# Altium schematic sheet Interface.SchDoc
size A
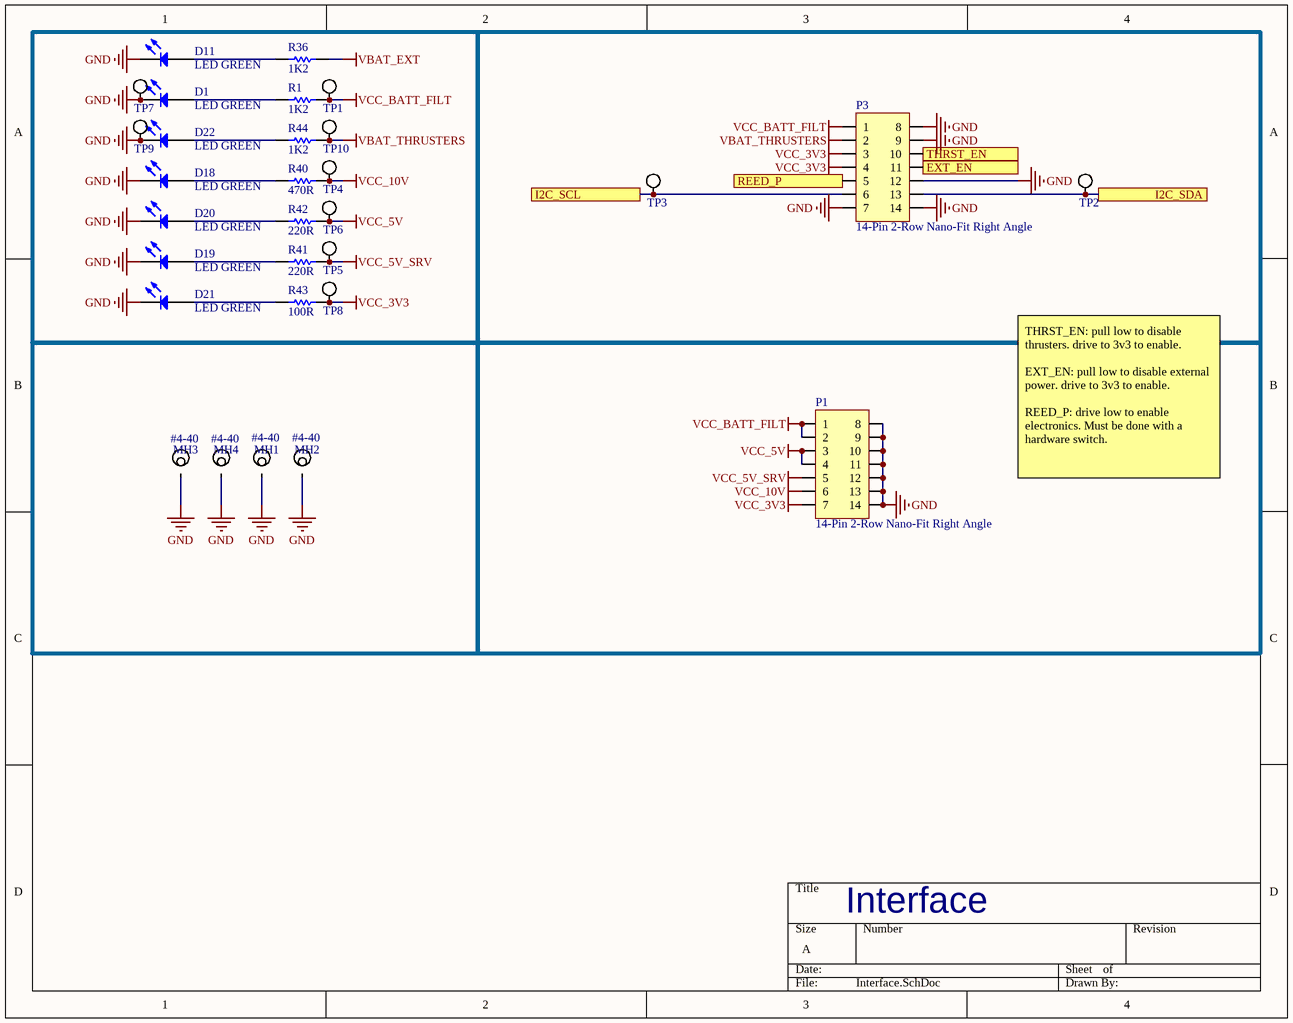
[diagram p0: Interface.SchDoc]

## Parts
D1  LED GREEN  [LED_0805]
D11  LED GREEN  [LED_0805]
D18  LED GREEN  [LED_0805]
D19  LED GREEN  [LED_0805]
D20  LED GREEN  [LED_0805]
D21  LED GREEN  [LED_0805]
D22  LED GREEN  [LED_0805]
MH1  #4-40  [Mounting Hole #4-40]
MH2  #4-40  [Mounting Hole #4-40]
MH3  #4-40  [Mounting Hole #4-40]
MH4  #4-40  [Mounting Hole #4-40]
P1  14-Pin 2-Row Nano-Fit Right Angle  [MOLEX NANO-FIT 2X7 - Right Angle]
P3  14-Pin 2-Row Nano-Fit Right Angle  [MOLEX NANO-FIT 2X7 - Right Angle]
R1  1K2  [RESC0603(1608)_L]
R36  1K2  [RESC0603(1608)_L]
R40  470R  [RESC0603(1608)_L]
R41  220R  [RESC0603(1608)_L]
R42  220R  [RESC0603(1608)_L]
R43  100R  [RESC0603(1608)_L]
R44  1K2  [RESC0603(1608)_L]
TP1  Test Point Loop  [Test Point Loop - Black]  (value not drawn)
TP2  Test Point Loop  [Test Point Loop - Black]  (value not drawn)
TP3  Test Point Loop  [Test Point Loop - Black]  (value not drawn)
TP4  Test Point Loop  [Test Point Loop - Black]  (value not drawn)
TP5  Test Point Loop  [Test Point Loop - Black]  (value not drawn)
TP6  Test Point Loop  [Test Point Loop - Black]  (value not drawn)
TP7  Test Point Loop  [Test Point Loop - Black]  (value not drawn)
TP8  Test Point Loop  [Test Point Loop - Black]  (value not drawn)
TP9  Test Point Loop  [Test Point Loop - Black]  (value not drawn)
TP10  Test Point Loop  [Test Point Loop - Black]  (value not drawn)

## Ports
EXT_EN (out), I2C_SCL, I2C_SDA, REED_P, THRST_EN (out)

## Nets
GND: D1.1(K) D11.1(K) D18.1(K) D19.1(K) D20.1(K) D21.1(K) D22.1(K) MH1.0 MH2.0 MH3.0 MH4.0 P1.8 P1.9 P1.10 P1.11 P1.12 P1.13 P1.14 P3.7 P3.8 P3.9 P3.12 P3.14 TP7.1 TP9.1
VBAT_EXT: R36.2
VBAT_THRUSTERS: P3.2 R44.2 TP10.1
VCC_3V3: P1.7 P3.3 P3.4 R43.2 TP8.1
VCC_5V: P1.3 P1.4 R42.2 TP6.1
VCC_5V_SRV: P1.5 R41.2 TP5.1
VCC_10V: P1.6 R40.2 TP4.1
VCC_BATT_FILT: P1.1 P1.2 P3.1 R1.2 TP1.1
EXT_EN: P3.11 ; port EXT_EN
I2C_SCL: P3.6 TP3.1 ; port I2C_SCL
I2C_SDA: P3.13 TP2.1 ; port I2C_SDA
REED_P: P3.5 ; port REED_P
THRST_EN: P3.10 ; port THRST_EN
NetD1_2: D1.2(A) R1.1
NetD11_2: D11.2(A) R36.1
NetD18_2: D18.2(A) R40.1
NetD19_2: D19.2(A) R41.1
NetD20_2: D20.2(A) R42.1
NetD21_2: D21.2(A) R43.1
NetD22_2: D22.2(A) R44.1

## Notes on the sheet
- THRST_EN: pull low to disable thrusters. drive to 3v3 to enable.
  EXT_EN: pull low to disable external power. drive to 3v3 to enable.
  REED_P: drive low to enable electronics. Must be done with a hardware switch.
- Interface

## Library data of the parts
D1 D11 D18-D22 = LED0: led; Manufacturer: Lite-On Inc.; Manufacturer Part Number: LTST-C171KGKT; Lens Color: Colorless; Lens Transparency: Clear; Millicandela Rating: 35mcd; Lens Style/Size: Rectangle with Flat Top, 1.40mm x 1.25mm; Voltage - Forward (Vf) (Typ): 2V; Current - Test: 20mA; Viewing Angle: 130°; Wavelength - Dominant: 571nm; Wavelength - Peak: 574nm; Supplier 1: Digi-Key; Supplier Part Number 1: 160-1426-1-ND; RoHS: RoHS Compliant; Category: Optoelectronics; Stock 1: 350441; Pricing 1: 1=0.31, 10=0.225, 25=0.1656, 100=0.1183, 250=0.0804, 500=0.07096, 1000=0.05558 (USD); Packaging: Cut Tape (CT); Part Status: Active; Color: Green; Mounting Type: Surface Mount; Features: -; Package / Case: 0805 (2012 Metric); Size / Dimension: 2.00mm L x 1.25mm W; Height (Max): 0.90mm; ComponentLink1URL: http://optoelectronics.liteon.com/upload/download/DS22-2000-118/LTST-C171KGKT.pdf; ComponentLink1Description: http://optoelectronics.liteon.com/upload/download/DS22-2000-118/LTST-C171KGKT.pdf
MH1-MH4 = Mounting Hole #4-40, Loose Fit: Mounting Hole for ANSI #4-40 w/ Flat Washer, Loose Fit; Datasheet: http://blogs.mentor.com/tom-hausherr/blog/tag/pcb-mounting-holes/
P1 P3 = 14-Pin 2-Row Nano-Fit Right Angle: NanoFit Right Hdr TH DR 14Ckt; Part Number: 105314-1214; Manufacturer: Molex; Supplier: Mouser; Supplier Part Number: 538-105314-1214; Supplier 1: Mouser; Supplier Part Number 1: 538-105314-1214; ComponentLink1Description: Mouser Link; ComponentLink1URL: https://www.mouser.com/ProductDetail/Molex/105314-1214?qs=PqFvFmEiOr6wLIXpvlvqbA%3D%3D
R1 R36 R44 = CMP-1012-00518-1: 1K2 0.1W 1% 0603 (1608 Metric)  SMD; Case-EIA: 0603; Value: 1200.00 Ohm; Case-Metric: 1608; Power: 0.1 W; Technology: SMT; Tolerance: 1 %
R40 = CMP-1012-00473-1: 470R 0.1W 1% 0603 (1608 Metric)  SMD; Value: 470.00 Ohm; Case-Metric: 1608; Case-EIA: 0603; Power: 0.1 W; Technology: SMT; Tolerance: 1 %
R41 R42 = CMP-1012-00058-1: 220R 0.1W 5% 0603 (1608 Metric)  SMD; Case-EIA: 0603; Case-Metric: 1608; Value: 220.00 Ohm; Technology: SMT; Power: 0.1 W; Tolerance: 5 %
R43 = CMP-1012-00050-1: 100R 0.1W 5% 0603 (1608 Metric)  SMD; Case-EIA: 0603; Value: 100.00 Ohm; Case-Metric: 1608; Tolerance: 5 %; Technology: SMT; Power: 0.1 W
TP1-TP10 = Test Point Loop: Keyston Electronics 5001 Test Point Loop; Manufacturer P/N: 5001; Manufacturer: Keystone Electronics; Color: Black; Supplier 1: Digi-Key; Supplier Part Number 1: 36-5001-ND